# EAGLE design ATTiny10DevBrd (EAGLE 6.4)
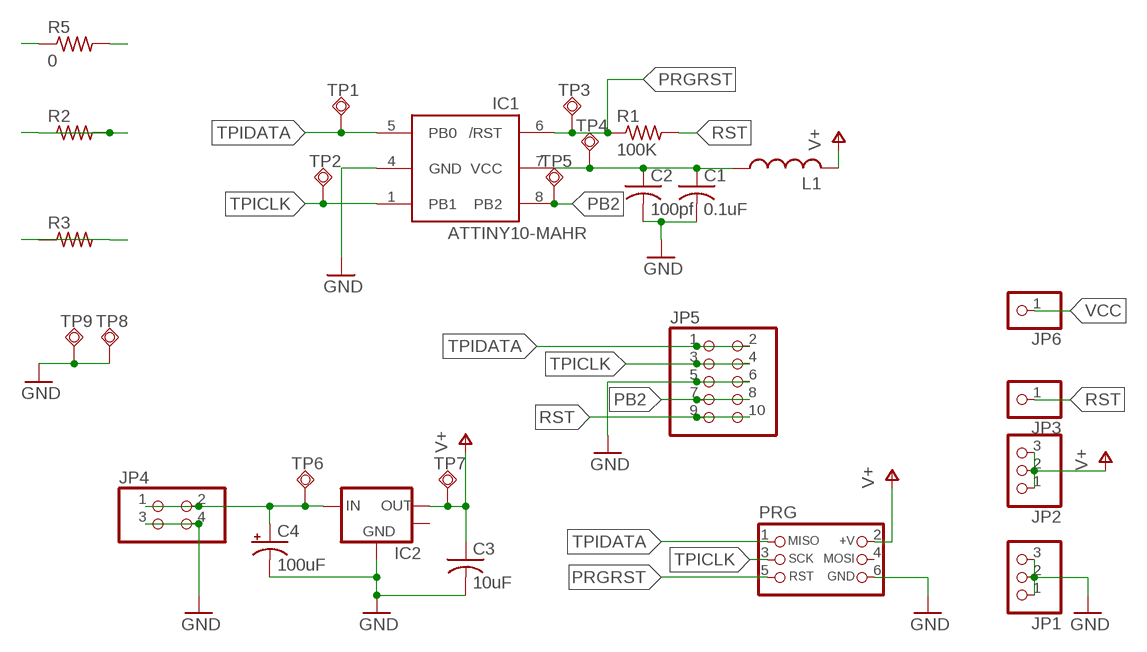
[diagram p0: schematic, sheet 1]

## Parts
C1  0.1uF  C-USC0603  [C0603]
C2  100pf  C-USC0402  [C0402]
C3  10uF  C-USC0805K  [C0805K]
C4  100uF  CPOL-USE  [PANASONIC_E]
IC1  ATTINY10-MAHR  [UDFN-8]
IC2  V_REG_LM1117SOT223  [SOT223]
JP1  PINHD-1X3  [1X03]
JP2  PINHD-1X3  [1X03]
JP3  PINHD-1X1  [1X01]
JP4  PINHD-2X2  [2X02]
JP5  PINHD-2X5  [2X05]
JP6  PINHD-1X1  [1X01]
L1  L-USL1812  [L1812]
PRG  CON_HEADER_PRG_AVR_ICSP_ETCH  [HEADER_PRG_2X03_ETCH]
R1  100K  R-US_R0805  [R0805]
R2  R-US_M1206  [M1206]
R3  R-US_M1206  [M1206]
R5  0  R-US_M0805  [M0805]
TP1  TPSQTP12R  [TP12R]
TP2  TPSQTP12R  [TP12R]
TP3  TPSQTP12R  [TP12R]
TP4  TPSQTP12R  [TP12R]
TP5  TPSQTP12R  [TP12R]
TP6  TPSQTP12R  [TP12R]
TP7  TPSQTP12R  [TP12R]
TP8  TPSQTP12R  [TP12R]
TP9  TPSQTP12R  [TP12R]

## Nets
GND: C1.2 C2.2 C3.2 C4.- IC1.4(GND) IC2.1(GND) JP1.1 JP1.2 JP1.3 JP4.3 JP4.4 JP5.5 JP5.6 PRG.6(GND) TP8.TP TP9.TP
PB2: IC1.8(PB2) JP5.7 JP5.8 R3.1 R3.2 TP5.TP
PRGRST: IC1.6(/RST) PRG.5(RST) R1.1 TP3.TP
RST: JP3.1 JP5.9 JP5.10 R1.2
TPICLK: IC1.1(PB1) JP5.3 JP5.4 PRG.3(SCK) R2.1 R2.2 TP2.TP
TPIDATA: IC1.5(PB0) JP5.1 JP5.2 PRG.1(MISO) R5.1 R5.2 TP1.TP
V+: C3.1 IC2.2(VR-OUTSM) JP2.1 JP2.2 JP2.3 L1.2 PRG.2(+V) TP7.TP
VCC: C1.1 C2.1 IC1.7(VCC) JP6.1 L1.1 TP4.TP
VIN: C4.+ IC2.3(IN) JP4.1 JP4.2 TP6.TP
Unconnected: IC2.4(OUT) PRG.4(MOSI)

## Library data of the parts
C1 C2 = adafruit:C-US: CAPACITOR, American symbol
C3 = LL:C-US: CAPACITOR, American symbol
C4 = LL:CPOL-US: POLARIZED CAPACITOR, American symbol Footprints somewhat modified from Adafruits (1206)
IC1 = LL:ATTINY10: ATtiny4/5/9/10 8-bit Microcontroller with 512/1024 Bytes In-System Programmable Flash (Derived from adafruit's, but made for etch)
IC2 = LL:V_REG_LM1117: Voltage Regulator LM1117 Standard adjustable voltage regulator but in SMD form. Fixed voltage type.
JP1 JP2 = adafruit:PINHD-1X3: PIN HEADER
JP3 JP6 = adafruit:PINHD-1X1: Pin header 1x1 for 0.1" spacing With round pins
JP4 = pinhead:PINHD-2X2: PIN HEADER
JP5 = pinhead:PINHD-2X5: PIN HEADER
L1 = LL:L-US: INDUCTOR, American symbol
PRG = LL:CON_HEADER_PRG_AVR_ICSP_ETCH: 2x3 AVR ICSP programming header for etching
R1-R3 R5 = LL:R-US_: RESISTOR, American symbol
TP1-TP9 = testpad:TPSQ: Test pad

## Board
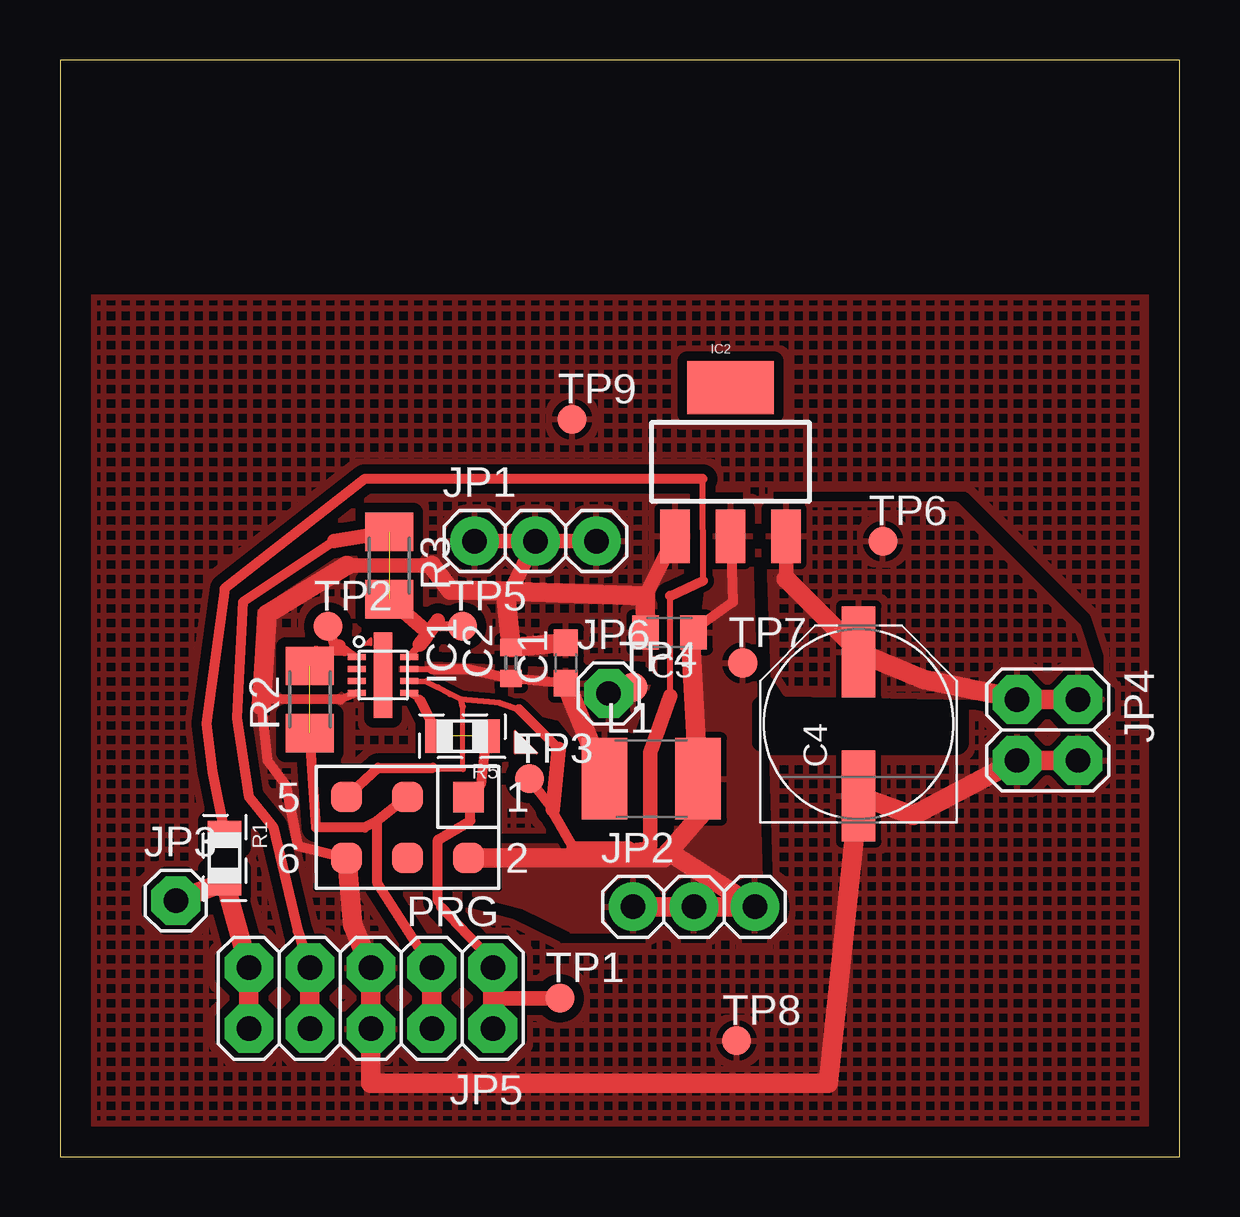
[diagram p1: board, top side]
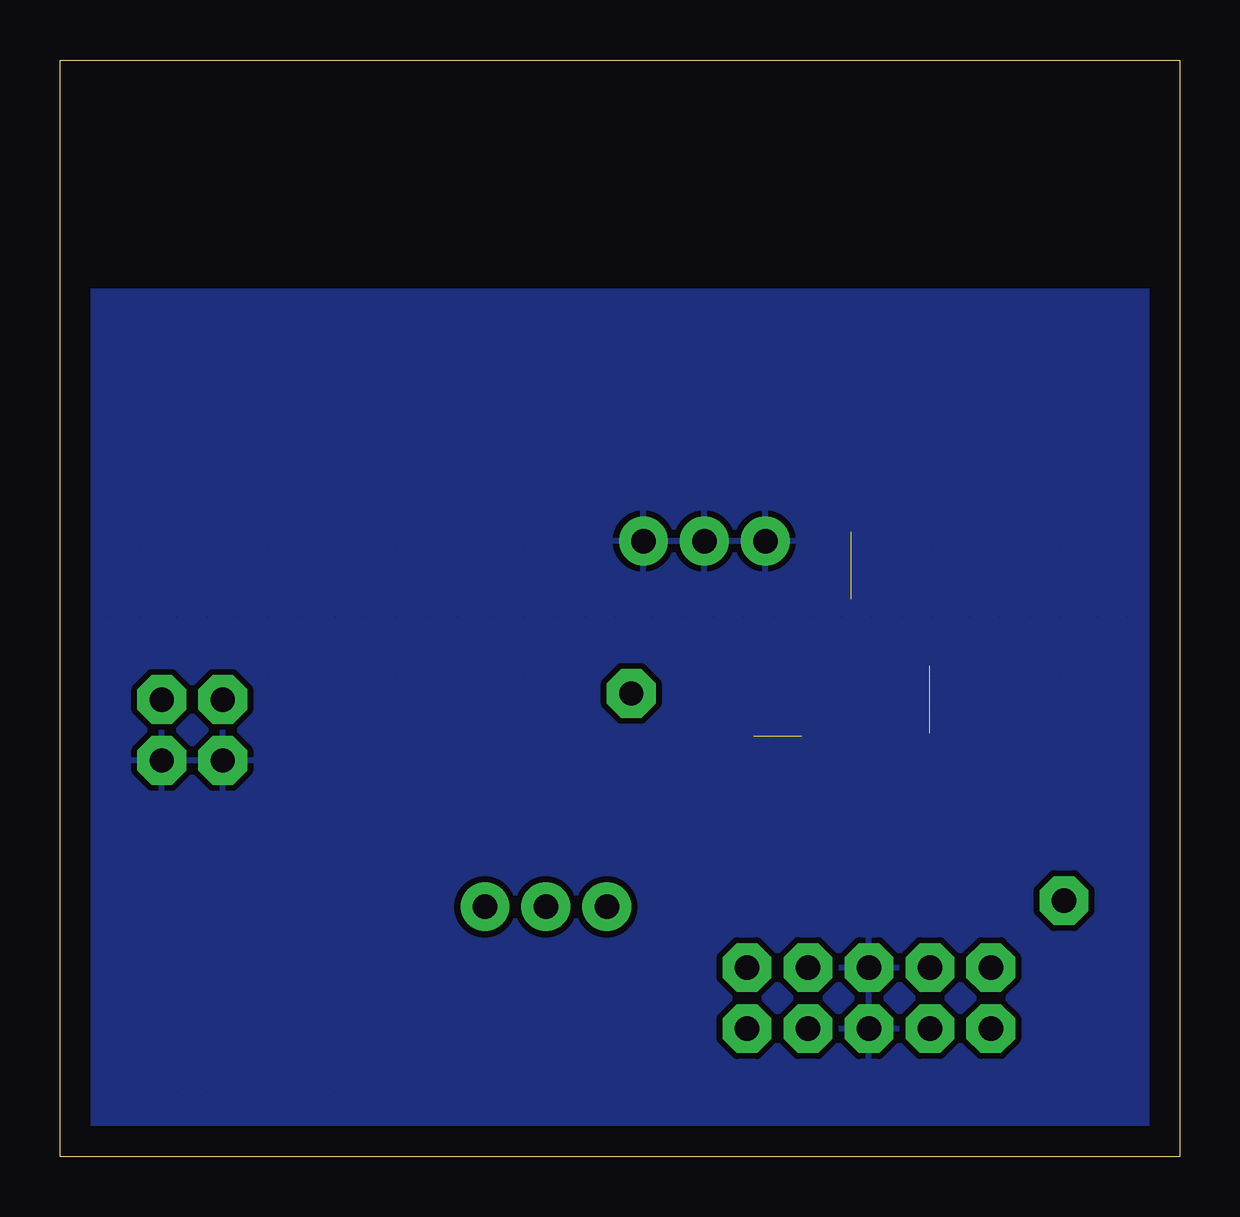
[diagram p2: board, bottom side, seen from below]

Size 46.66 x 45.71 mm. Coordinates in mm from the lower left corner, seen from the top.
Outline: 0,0 46.66,0 46.66,45.71 0,45.71 0,0
Copper layers (1*16): Top 0.0356mm / dielectric 1.5011mm / Bottom 0.0356mm
Design rules "ll-etch-lax": minimum track width 8mil, minimum drill 21mil, track to track 8mil, track to pad 7mil, pad to pad 12mil, via to via 20mil, smd to smd 4mil, copper to edge 50mil, drill to drill 30mil, minimum pad ring 20mil, minimum via ring 18mil, stop-mask expansion 0mil, vias tented up to drill 20mil, thermal gap 10mil
tRestrict: area 29.2,17.3 to 37.3,18.8

### Footprints (pad centres in the part's own frame; a part is rotated, then mirrored left to right if it is on the bottom)
C0603 = smd 1.1 x 1: 1 -0.85,0; 2 0.85,0
C0402 = smd 0.7 x 0.9: 1 -0.65,0; 2 0.65,0
C0805K = smd 1.1 x 1.4: 1 -1,0; 2 1,0
PANASONIC_E = smd 3.8 x 1.4: + 3,0; - -3,0
UDFN-8 = smd 0.25 x 0.75: 1 -0.75,-1.1; 2 -0.25,-1.1; 3 0.25,-1.1; 4 0.75,-1.1; 5 0.75,1.1; 6 0.25,1.1; 7 -0.25,1.1; 8 -0.75,1.1 | smd 3.556 x 0.762: THERM 0,0
SOT223 = smd 1.219 x 2.235: 1 -2.311,-3.099; 2 0,-3.099; 3 2.311,-3.099 | smd 3.6 x 2.2: 4 0,3.099
1X03 = drill 1.016: 1 -2.54,0; 2 0,0; 3 2.54,0
1X01 = drill 1.016 pad 1.93 octagon: 1 0,0
2X02 = drill 1.016 octagon: 1 -1.27,-1.27; 2 -1.27,1.27; 3 1.27,-1.27; 4 1.27,1.27
2X05 = drill 1.016 octagon: 1 -5.08,-1.27; 2 -5.08,1.27; 3 -2.54,-1.27; 4 -2.54,1.27; 5 0,-1.27; 6 0,1.27; 7 2.54,-1.27; 8 2.54,1.27; 9 5.08,-1.27; 10 5.08,1.27
L1812 = smd 1.9 x 3.4: 1 -1.95,0; 2 1.95,0
HEADER_PRG_2X03_ETCH = smd 1.27 x 1.27: 1 -2.54,-1.27; 2 -2.54,1.27; 3 0,-1.27; 4 0,1.27; 5 2.54,-1.27; 6 2.54,1.27
R0805 = smd 1.1 x 1.4: 1 -1,0; 2 1,0
M1206 = smd 1.6 x 2: 1 -1.4,0; 2 1.4,0
TP12R = smd 1.2 x 1.2: TP 0,0

### Placement (x,y rotation side)
C1  21.08,20.57 90 top
C2  18.8,20.57 90 top
C3  25.4,21.84 180 top
C4  33.27,18.03 90 top
IC1  13.46,20.07 270 top
IC2  27.94,28.96 0 top
JP1  19.81,25.65 0 top
JP2  26.42,10.41 0 top
JP3  4.83,10.67 0 top
JP4  41.15,17.78 270 top
JP5  12.95,6.6 180 top
JP6  22.86,19.3 0 top
L1  24.64,15.75 0 top
PRG  14.48,13.72 180 top
R1  6.86,12.45 270 top
R2  10.41,19.05 90 top
R3  0  [M1206]  13.72,24.64 270 top
R5  0  [R0805]  16.76,17.53 180 top
TP1  20.83,6.6 0 top
TP2  11.18,22.1 0 top
TP3  19.56,15.75 0 top
TP4  23.88,19.56 0 top
TP5  16.76,22.1 0 top
TP6  34.29,25.65 0 top
TP7  28.45,20.57 0 top
TP8  28.19,4.83 0 top
TP9  21.34,30.73 0 top

### Tracks (layer width: path | path; a pad name or v marks a point on that pad's centre or on a via)
GND
  Top 0.305: IC1.4 11.68,19.05
  Top 0.406: PRG.6 9.91,12.95 9.4,15.49 8.64,16.51 8.38,18.8 | 11.68,19.05 8.4,19.08
  Top 0.61: 11.94,24.64 15.49,24.64 | JP1.2 18.78,23.57 | JP1.2 JP1.1 | JP1.2 JP1.3 | IC2.1 24.38,23.37
  Top 0.813: 15.49,24.64 16.26,23.62 18.56,23.58 | 18.56,23.58 18.78,23.57 19.07,23.56 20.85,23.49 24.38,23.37 C3.2 | 11.94,24.64 8.64,22.61 8.4,19.08 8.38,18.8 | 18.56,23.58 C2.2 C1.2 | PRG.6 12.19,9.65 JP5.5 JP5.6 12.95,3.05 32,3.05 C4.- 35.56,14.22 JP4.3 JP4.4
  pour Top (isolate 0.406, rank 3, hatched): 1.27,1.02 45.72,1.02 45.72,35.81 1.27,35.81
  pour Bottom (isolate 0.254, hatched): 1.27,1.02 45.72,1.02 45.72,36.07 1.27,36.07
N$1
  cutout Top: 10.92,16.26 10.67,11.18 18.29,11.18 18.29,16.26
PB2  (1 unrouted)
  Top 0.305: IC1.8 14.99,21.34
  Top 0.406: 11.43,25.65 7.62,23.11 7.37,18.29 7.87,14.99 8.89,13.72 9.91,9.4 JP5.7 | TP5.TP 15.75,22.1 15.75,22.35
  Top 0.61: 14.99,21.34 15.23,21.66 15.35,21.82 | 15.35,21.82 15.75,22.35 | 11.43,25.65 R3.1 | R3.2 15.35,21.82
  Top 0.813: JP5.7 JP5.8
PRGRST
  Top 0.203: 16.79,16.15 16.79,18.75
  Top 0.254: IC1.6 15.24,19.81 15.75,19.56 16.26,19.28 16.73,19.06 | 16.79,18.75 16.73,19.06 | 16.79,16.15 15.54,16.18 15.54,16.2 | 26.8,24 26.77,28.25 | 25.43,19.2 25.43,23.37 | 19.13,18.64 18.34,18.9 16.73,19.06
  Top 0.305: 20.52,14.48 20.52,14.38
  Top 0.406: 15.54,16.2 13.26,16.2 PRG.5 | R1.1 6.35,16.03 6.1,18.06 6.86,23.67 12.7,28.25 26.77,28.25 | 25.43,23.37 26.8,24 | 23.7,12.85 24.59,12.98 | 19.13,18.64 20.78,16.99 | 21.41,12.85 20.52,14.38 | TP3.TP 20.52,14.48
  Top 0.61: 25.43,19.2 24.59,16.84 24.59,12.98 | 21.41,12.85 23.7,12.85 | 20.78,16.99 20.52,14.48
RST
  Top 0.813: JP5.10 JP5.9 R1.2 JP3.1
TPICLK  (1 unrouted)
  Top 0.254: IC1.1 11.93,21.15 | 11.93,21.15 11.68,21.34 | 11.86,21.06 11.93,21.15
  Top 0.406: 11.86,21.06 10.67,21.08 R2.2 | PRG.3 13.21,13.97 | 13.21,13.97 13.21,11.43 JP5.3 | 13.21,13.97 12.7,13.72 10.67,13.72 R2.1 | 11.68,21.34 11.43,21.34 TP2.TP
  Top 0.813: JP5.3 JP5.4
TPIDATA  (1 unrouted)
  Top 0.254: 15.88,10.39 15.75,10.64 | JP5.1 18.16,8 | 17.09,14.88 PRG.1 | IC1.5 14.99,19.05
  Top 0.406: 17.09,14.88 17.09,13.99 15.75,13.21 15.75,10.64 | 18.16,8 15.88,10.39 | 14.99,19.05 R5.2 | R5.1 17.53,15.49 PRG.1 | 18.03,6.6 18.03,6.35
  Top 0.61: TP1.TP 18.03,6.6
  Top 0.813: JP5.1 18.03,6.35 JP5.2
V+
  Top 0.254: IC2.2 27.94,25.81 | 26.26,21.84 C3.1
  Top 0.406: 26.26,21.84 28.04,23.11 27.94,25.81
  Top 0.813: PRG.2 25.15,12.45 25.36,12.7 | 25.36,12.7 26.67,14.22 L1.2 26.26,21.84 | JP2.1 JP2.2 JP2.3 25.36,12.7
  pour Top (isolate 0.254): 17.27,12.95 25.65,12.95 25.65,13.21 27.43,27.18 28.7,27.18 29.21,9.4 21.34,9.4 19.3,10.41 17.27,10.92
VCC
  Top 0.254: IC1.7 15.49,20.32
  Top 0.406: 15.49,20.32 17.02,20.32 C2.1 C1.1
  Top 0.813: C1.1 L1.1
  pour Top (isolate 0.254): 24.64,20.07 14.22,20.57 14.22,19.81 20.83,18.29 21.84,17.02 23.62,17.02
VIN
  Top 0.254: 33.27,21.06 C4.+ 33.38,20.98 | 39.78,19.13 JP4.1
  Top 0.61: 30.25,24.08 IC2.3
  Top 0.813: JP4.2 JP4.1 | 33.27,21.06 30.25,24.08 | 39.78,19.13 35.99,19.89 33.38,20.98
  pour Top (hatched): 29.46,27.18 29.72,20.07 30.23,19.3 43.43,19.05 42.42,22.1 37.34,27.18